# EAGLE design Sen (EAGLE 6.0)
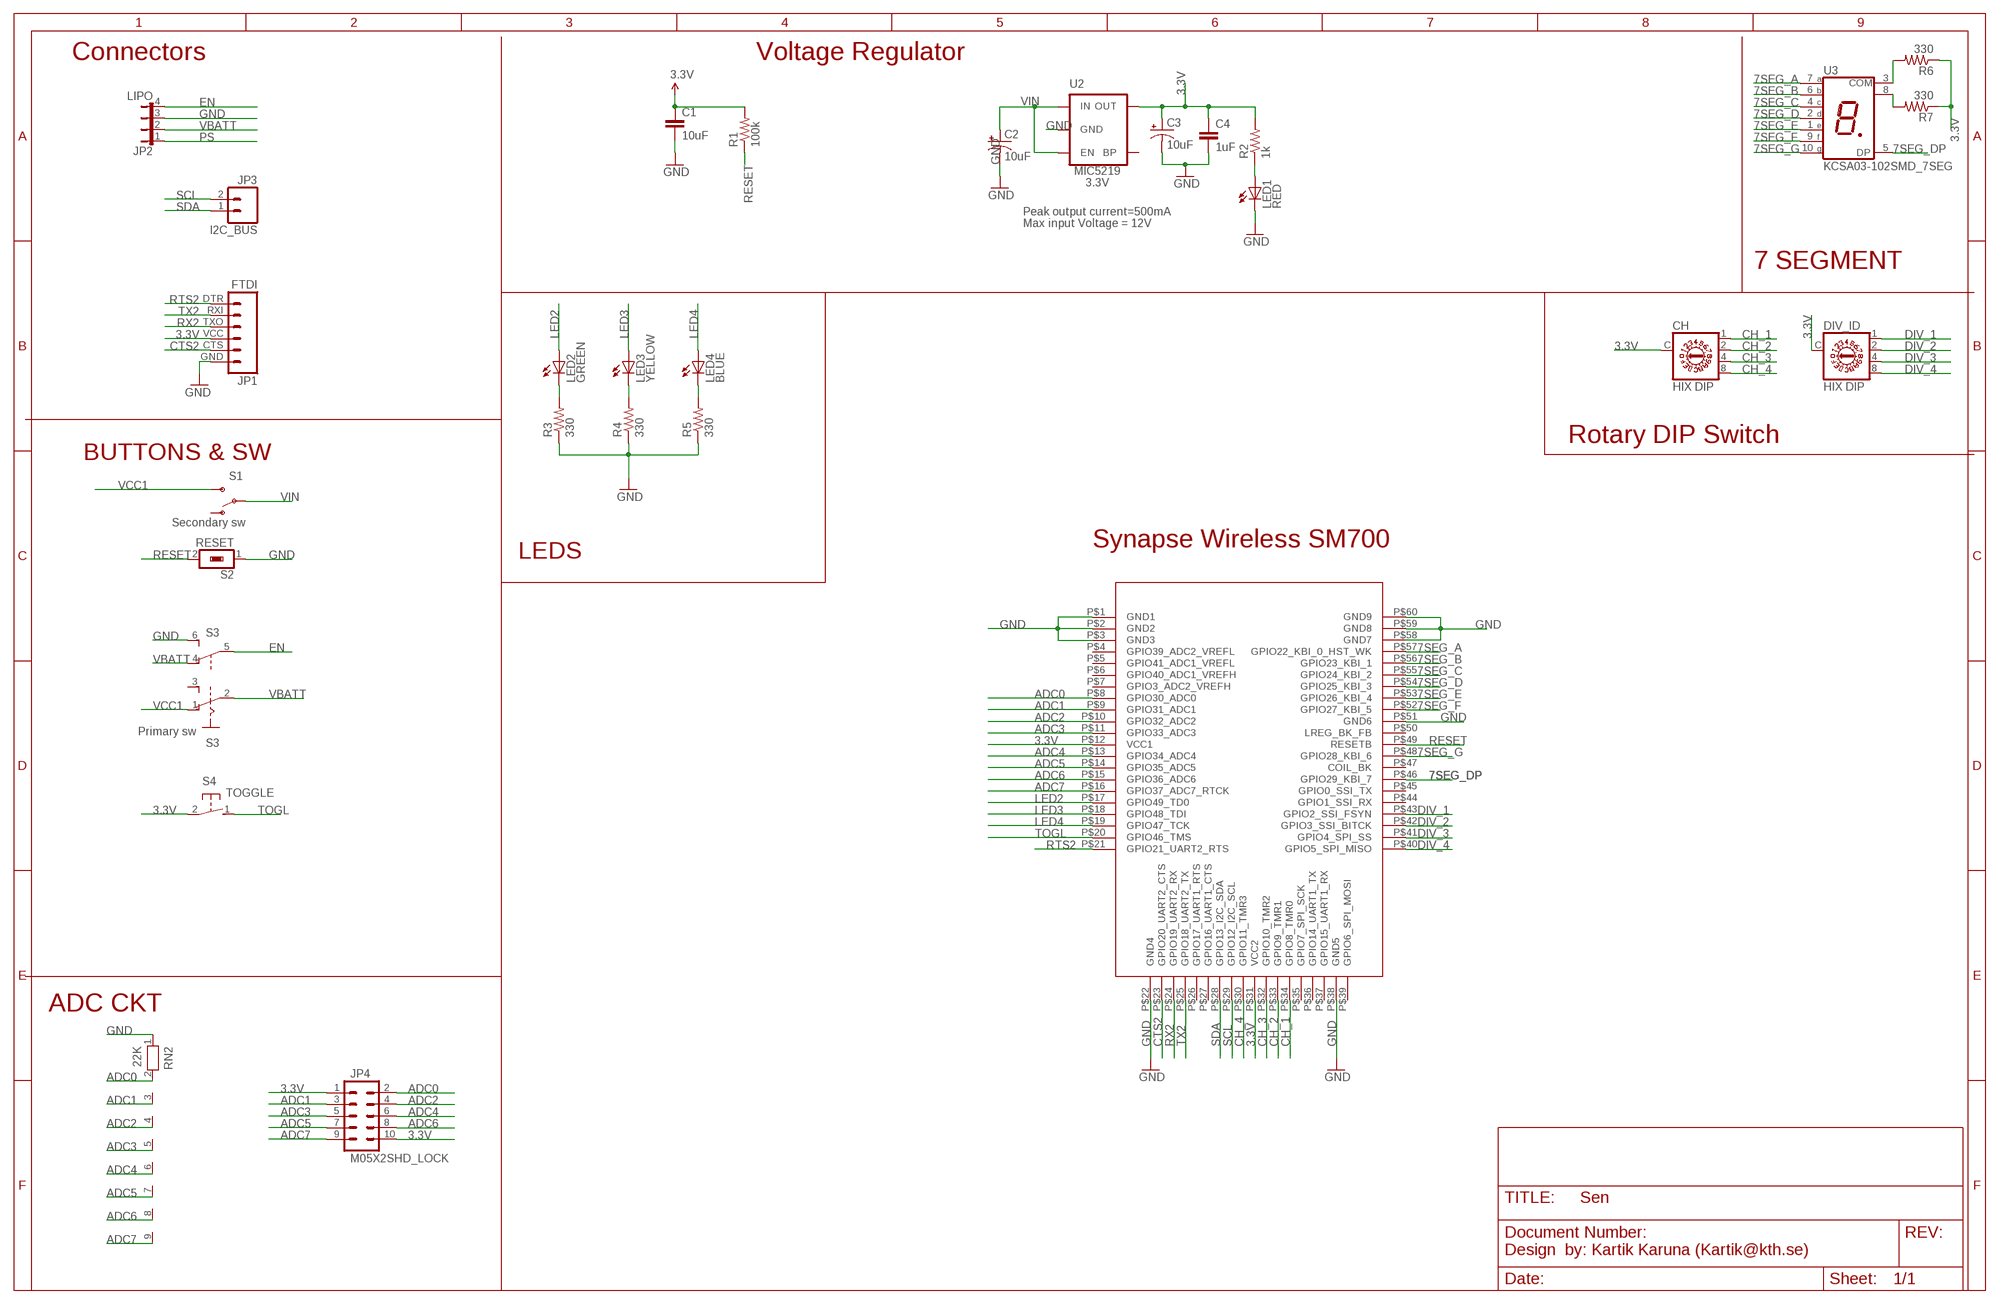
[diagram p0: schematic, sheet 1]

## Parts
C1  10uF  CAP0603-CAP  [0603-CAP]
C2  10uF  CAP_POL3528  [EIA3528]
C3  10uF  CAP_POL3528  [EIA3528]
C4  1uF  CAP0402-CAP  [0402-CAP]
CH  HIX DIP  A1353HEX  [A1353HEX]
DIV_ID  HIX DIP  A1353HEX  [A1353HEX]
JP1  FTDI  FTDI_BASICPTH  [FTDI_BASIC]
JP2  LIPO  JP4E  [JP4]
JP3  I2C_BUS  M021X02_NO_SILK  [1X02_NO_SILK]
JP4  M05X2SHD_LOCK  [2X5-SHROUDED_LOCK]
LED1  RED  LED0603  [LED-0603]
LED2  GREEN  LED0603  [LED-0603]
LED3  YELLOW  LED0603  [LED-0603]
LED4  BLUE  LED0603  [LED-0603]
R1  100k  RESISTOR0805-RES  [0805]
R2  1k  RESISTOR0805-RES  [0805]
R3  330  RESISTOR0603-RES  [0603-RES]
R4  330  RESISTOR0603-RES  [0603-RES]
R5  330  RESISTOR0603-RES  [0603-RES]
R6  330  RESISTOR0603-RES  [0603-RES]
R7  330  RESISTOR0603-RES  [0603-RES]
RN2  22K  RN08  [RN-9]
S1  Secondary sw  SWITCH-SPDTSMD  [AYZ0202]
S2  RESET  TYCO_FSMSFSMSM  [TYCO_FSM]
S3  Primary sw  A68-A31  [A68-A31]
S4  TOGGLE  TYCO_FSMRACDA  [TYCO_FSMRACDA]
U1  SM700PC1SMD  [SYNAPSE_SN700PC1]
U2  MIC5219  V_REG_LDOSMD  [SOT23-5]
U3  KCSA03-102SMD_7SEG  [SMD-7SEG]

## Nets
3.3V: C1.1 C3.A(+) C4.1 CH.C DIV_ID.C JP1.VCC JP4.1 JP4.10 R1.2 R2.2 R6.1 R7.1 S4.2 U1.P$12(VCC1) U1.P$31(VCC2) U2.5(OUT)
7SEG_A: U1.P$57(GPIO22_KBI_0_HST_WK) U3.7(A)
7SEG_B: U1.P$56(GPIO23_KBI_1) U3.6(B)
7SEG_C: U1.P$55(GPIO24_KBI_2) U3.4(C)
7SEG_D: U1.P$54(GPIO25_KBI_3) U3.2(D)
7SEG_DP: U1.P$46(GPIO29_KBI_7) U3.5(DP)
7SEG_E: U1.P$53(GPIO26_KBI_4) U3.1(E)
7SEG_F: U1.P$52(GPIO27_KBI_5) U3.9(F)
7SEG_G: U1.P$48(GPIO28_KBI_6) U3.10(G)
ADC0: JP4.2 RN2.2 U1.P$8(GPIO30_ADC0)
ADC1: JP4.3 RN2.3 U1.P$9(GPIO31_ADC1)
ADC2: JP4.4 RN2.4 U1.P$10(GPIO32_ADC2)
ADC3: JP4.5 RN2.5 U1.P$11(GPIO33_ADC3)
ADC4: JP4.6 RN2.6 U1.P$13(GPIO34_ADC4)
ADC5: JP4.7 RN2.7 U1.P$14(GPIO35_ADC5)
ADC6: JP4.8 RN2.8 U1.P$15(GPIO36_ADC6)
ADC7: JP4.9 RN2.9 U1.P$16(GPIO37_ADC7_RTCK)
CH_1: CH.1 U1.P$34(GPIO8_TMR0)
CH_2: CH.2 U1.P$33(GPIO9_TMR1)
CH_3: CH.4 U1.P$32(GPIO10_TMR2)
CH_4: CH.8 U1.P$30(GPIO11_TMR3)
CTS2: JP1.CTS U1.P$23(GPIO20_UART2_CTS)
DIV_1: DIV_ID.1 U1.P$43(GPIO2_SSI_FSYN)
DIV_2: DIV_ID.2 U1.P$42(GPIO3_SSI_BITCK)
DIV_3: DIV_ID.4 U1.P$41(GPIO4_SPI_SS)
DIV_4: DIV_ID.8 U1.P$40(GPIO5_SPI_MISO)
EN: JP2.4 S3.5(B:P)
GND: C1.2 C2.C(-) C3.C(-) C4.2 JP1.GND JP2.3 LED1.C R3.1 R4.1 R5.1 RN2.1 S2.1 S3.6(B:S) U1.P$1(GND1) U1.P$2(GND2) U1.P$3(GND3) U1.P$22(GND4) U1.P$38(GND5) U1.P$51(GND6) U1.P$58(GND7) U1.P$59(GND8) U1.P$60(GND9) U2.2(GND)
LED2: LED2.A U1.P$17(GPIO49_TD0)
LED3: LED3.A U1.P$18(GPIO48_TDI)
LED4: LED4.A U1.P$19(GPIO47_TCK)
N$1: LED3.C R4.2
N$2: LED1.A R2.1
N$3: R6.2 U3.3(COM)
N$4: LED2.C R3.2
N$5: R7.2 U3.8(COM)
N$6: LED4.C R5.2
PS: JP2.1
RESET: R1.1 S2.2 U1.P$49(RESETB)
RTS2: JP1.DTR U1.P$21(GPIO21_UART2_RTS)
RX2: JP1.TXO U1.P$24(GPIO19_UART2_RX)
SCL: JP3.2 U1.P$29(GPIO12_I2C_SCL)
SDA: JP3.1 U1.P$28(GPIO13_I2C_SDA)
TOGL: S4.1 U1.P$20(GPIO46_TMS)
TX2: JP1.RXI U1.P$25(GPIO18_UART2_TX)
VBATT: JP2.2 S3.2(A:P) S3.4(B:O)
VCC1: S1.3(S) S3.1(A:O)
VIN: C2.A(+) S1.2(P) U2.1(IN) U2.3(EN)
Unconnected: S1.1(O) S3.3(A:S) U1.P$4(GPIO39_ADC2_VREFL) U1.P$5(GPIO41_ADC1_VREFL) U1.P$6(GPIO40_ADC1_VREFH) U1.P$7(GPIO3_ADC2_VREFH) U1.P$26(GPIO17_UART1_RTS) U1.P$27(GPIO16_UART1_CTS) U1.P$35(GPIO7_SPI_SCK) U1.P$36(GPIO14_UART1_TX) U1.P$37(GPIO15_UART1_RX) U1.P$39(GPIO6_SPI_MOSI) U1.P$44(GPIO1_SSI_RX) U1.P$45(GPIO0_SSI_TX) U1.P$47(COIL_BK) U1.P$50(LREG_BK_FB) U2.4(BP)

## Notes on the sheet
- Connectors | Voltage Regulator
- 3.3V
- Peak output current=500mA
- Max input Voltage = 12V
- 7 SEGMENT
- BUTTONS & SW | Rotary DIP Switch
- Synapse Wireless SM700
- LEDS
- ADC CKT
- Design  by: Kartik Karuna (Kartik@kth.se)

## Library data of the parts
C1 C4 = SparkFun-Passives:CAP: Capacitor Standard 0603 ceramic capacitor, and 0.1" leaded capacitor.
C2 C3 = SparkFun-Passives:CAP_POL: Capacitor Polarized These are standard SMD and PTH capacitors. Normally 10uF, 47uF, and 100uF in electrolytic and tantalum varieties. Always verify the external diameter of the through hole cap, it varies with capacity, voltage, and manufacturer. The EIA devices should be standard.
CH DIV_ID = switch-dil:A1353HEX: DIL/CODE SWITCH; OC_FARNELL: unknown; OC_NEWARK: unknown
JP1 = SparkFun-Connectors:FTDI_BASIC: FTDI Basic header with labels
JP2 = jumper:JP4E: JUMPER
JP3 = SparkFun-Connectors:M02: Header 2 Standard 2-pin 0.1" header. Use with straight break away headers (SKU : PRT-00116), right angle break away headers (PRT-00553), swiss pins (PRT-00743), machine pins (PRT-00117), and female headers (PRT-00115). Molex polarized connector foot print use with SKU : PRT-08233 with associated crimp pins and housings.
JP4 = SparkFun-Connectors:M05X2: Header 5x2 Standard 10-pin dual row 0.1" header. Commonly used with AVR-ISP. Use with Spark Fun Electronics SKU: PRT-00778
LED1-LED4 = SparkFun-LED:LED: LEDs Standard schematic elements and footprints for 5mm, 3mm, 1206, and 0603 sized LEDs. 5mm - Spark Fun Electronics SKU : COM-00529 (and others)
R1-R7 = SparkFun-Passives:RESISTOR: Resistor Basic schematic elements and footprints for 0603, 1206, and PTH resistors.
RN2 = resistor-net:RN08: RESISTOR NETWORK; OC_FARNELL: unknown; OC_NEWARK: unknown
S1 = SparkFun-Electromechanical:SWITCH-SPDT: SPDT Switch Simple slide switch, Spark Fun Electronics SKU : COM-00102 DPDT SMT slide switch, AYZ0202, SWCH-08179; PROD_ID: SWCH-08179
S2 = cy_fsmsm:TYCO_FSMS: FSMSM 12 VDC 50 mA, FSM-SM https://www1.elfa.se/data1/wwwroot/assets/datasheets/unAlcoswitch_FSM_dat_en.pdf
S3 = switch:A68-A31: SLIDING SWITCH Siemens, distributor Buerklin, 11G766
S4 = cy_fsmsm:TYCO_FSMRACDA: Rated voltage 12 VDC Rated current 50 mA Actuation force 100 g Design Through-Hole Switching type Momentary function Test voltage 250 V Contact material Ag Description FSMRACD https://www1.elfa.se/data1/wwwroot/assets/datasheets/unAlcoswitch_FSM_dat_en.pdf
U1 = Synapse_SM700PC1:SM700PC1: This device is an ARM7 32bit RF device made by Synapse-Wireless
U2 = SparkFun-PowerIC:V_REG_LDO: Voltage Regulator LDO Standard 150mA LDO voltage regulator in SOT-23 layout. Micrel part MIC5205. BP (by-pass) pin is used to lower output noise with 470pF cap.
U3 = cy-7-seg:KCSA03-102: SURFACE MOUNT DISPLAY Light colour green Character height 7.62 mm Polarity C.C. Decimal point right Peak wave length 565 nm Rated on-state current (per LED) 20 mA Forward voltage 2.2 VDC Light intensity typ. 10000 mcd@ 10 mA Conducting-state voltage max. 2.5 VDC https://www1.elfa.se/data1/wwwroot/assets/datasheets/caKingbright_SMD-LED-Display-KCSC03102_E.pdf

## Board
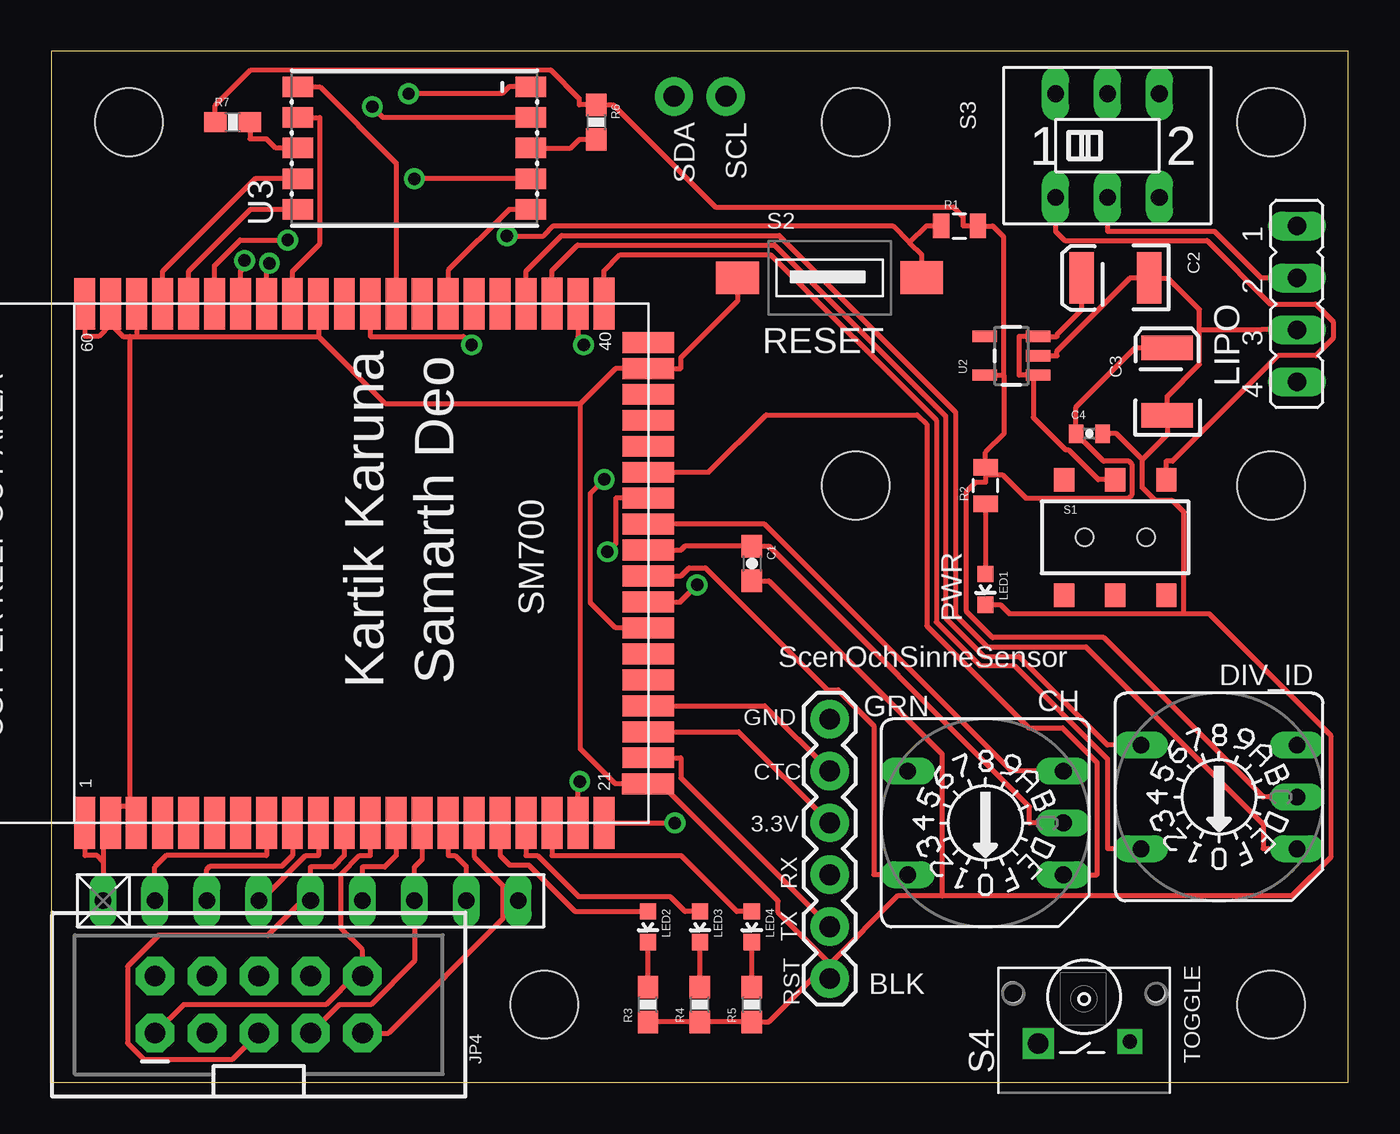
[diagram p1: board, top side]
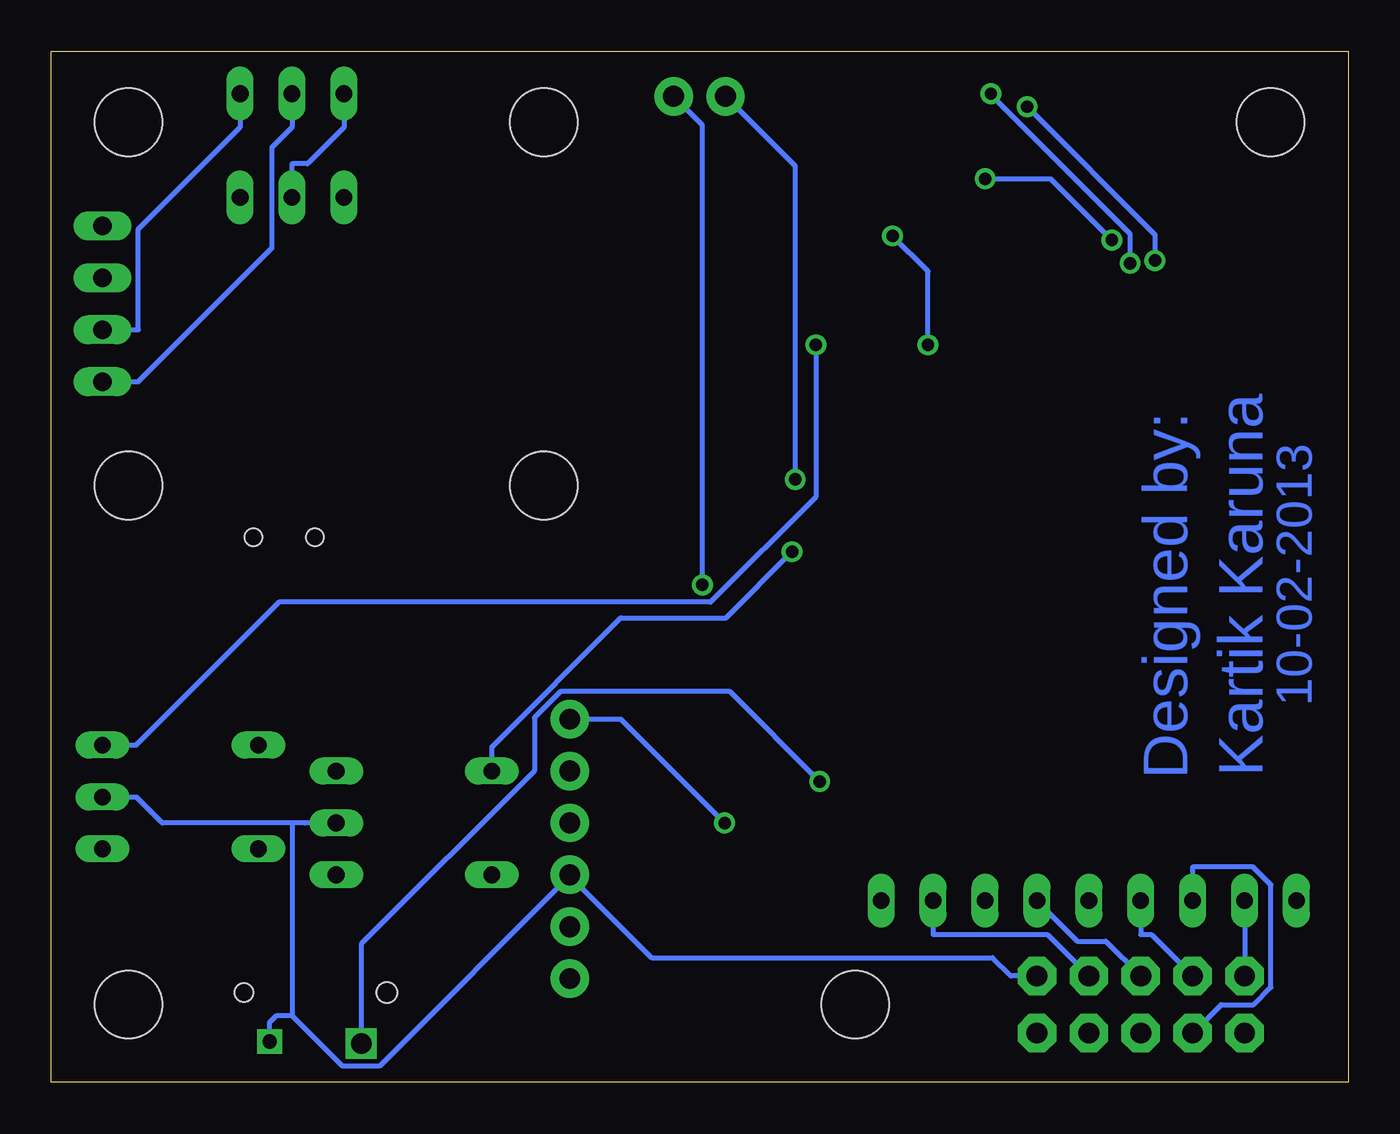
[diagram p2: board, bottom side, seen from below]

Size 63.48 x 50.47 mm. Coordinates in mm from the lower left corner, seen from the top.
Outline: 0,0 63.48,0 63.48,50.47 0,50.47 0,0
Copper layers (1*16): Top 0.035mm / dielectric 1.5mm / Bottom 0.035mm
Design rules: minimum track width 10mil, minimum drill 24mil, track to track 8mil, track to pad 8mil, pad to pad 8mil, via to via 8mil, smd to smd 8mil, copper to edge 40mil, drill to drill 8mil, minimum pad ring 10mil, minimum via ring 8mil, stop-mask expansion 4mil, vias tented up to drill 0mil, thermal gap 10mil
bKeepout: area 36.4,44.2 to 42.3,49.8
tRestrict: area 57.1,26.7 to 62.2,31.8; area 36.7,26.5 to 42.3,32.1; area 36.6,44.2 to 42.2,49.8; area 49.5,25.4 to 54.6,27.9; area 46.6,3.7 to 47.6,5; area 53.3,3.8 to 54.6,5.1
bRestrict: area 57.1,26.7 to 62.2,31.8; area 36.7,26.4 to 42.3,32.1; area 49.5,25.4 to 54.6,27.9; area 53.3,3.8 to 54.6,5.1; area 46.6,3.7 to 47.6,5

### Footprints (pad centres in the part's own frame; a part is rotated, then mirrored left to right if it is on the bottom)
0603-CAP = smd 1.1 x 1: 1 -0.85,0; 2 0.85,0
EIA3528 = smd 1.2 x 2.5: A 1.65,0; C -1.65,0
0402-CAP = smd 0.7 x 0.9: 1 -0.65,0; 2 0.65,0
A1353HEX = drill 0.813 long: 1 3.81,-2.54; 2 -3.81,2.54; 4 3.81,2.54; 8 -3.81,-2.54; C 3.81,0
FTDI_BASIC = drill 1.016 pad 1.88: CTS 10.16,0; DTR 0,0; GND 12.7,0; RXI 2.54,0; TXO 5.08,0; VCC 7.62,0
JP4 = drill 0.914 long: 1 -3.81,0; 2 -1.27,0; 3 1.27,0; 4 3.81,0
1X02_NO_SILK = drill 1.016 pad 1.88: 1 0,0; 2 2.54,0
2X5-SHROUDED_LOCK = drill 1.016 pad 1.88 octagon: 1 -1.397,5.08; 2 1.397,5.08; 3 -1.397,2.54; 4 1.397,2.54; 5 -1.397,0; 6 1.397,0; 7 -1.397,-2.54; 8 1.397,-2.54; 9 -1.397,-5.08; 10 1.397,-5.08
STAND-OFF = hole 3.302: 0,0
LED-0603 = smd 0.8 x 0.8: A 0,-0.75; C 0,0.75
0805 = smd 0.8 x 1.2: 1 -0.9,0; 2 0.9,0
0603-RES = smd 1.1 x 1: 1 -0.85,0; 2 0.85,0
RN-9 = drill 0.813 long: 1 -10.16,0; 2 -7.62,0; 3 -5.08,0; 4 -2.54,0; 5 0,0; 6 2.54,0; 7 5.08,0; 8 7.62,0; 9 10.16,0
AYZ0202 = smd 1 x 1.15: 1 -2.5,2.825; 2 0,2.825; 3 2.5,2.825; 4 -2.5,-2.825; 5 0,-2.825; 6 2.5,-2.825 | hole 0.85: 1.5,0; -1.5,0
TYCO_FSM = smd 1.6 x 2.1: 1 0,-4.51; 2 -0.01,4.5
A68-A31 = drill 0.813 long: 1 -2.54,-2.54; 2 0,-2.54; 3 2.54,-2.54; 4 -2.54,2.54; 5 0,2.54; 6 2.54,2.54
TYCO_FSMRACDA = drill 1 square: 1 0,2.24 | drill 0.7 square: 2 0.1,-2.24 | hole 1: 2.5,3.5 | hole 0.9: 2.5,-3.5
SYNAPSE_SN700PC1 = smd 2.54 x 1.02: P$1 0,28.83; P$2 0,27.56; P$3 0,26.32; P$4 0,25.02; P$5 0,23.75; P$6 0,22.48; P$7 0,21.21; P$8 0,19.94; P$9 0,18.67; P$10 0,17.4; P$11 0,16.13; P$12 0,14.86; P$13 0,13.59; P$14 0,12.32; P$15 0,11.05; P$16 0,9.78; P$17 0,8.51; P$18 0,7.24; P$19 0,5.97; P$20 0,4.7; P$21 0,3.43; P$40 25.41,3.43; P$41 25.4,4.7; P$42 25.42,5.97; P$43 25.4,7.24; P$44 25.4,8.51; P$45 25.4,9.78; P$46 25.4,11.05; P$47 25.4,12.32; P$48 25.4,13.59; P$49 25.4,14.86; P$50 25.4,16.13; P$51 25.4,17.4; P$52 25.4,18.67; P$53 25.4,19.94; P$54 25.4,21.21; P$55 25.4,22.48; P$56 25.4,23.75; P$57 25.4,25.02; P$58 25.4,26.29; P$59 25.4,27.56; P$60 25.4,28.83 | smd 1.02 x 2.54: P$22 1.91,1.27; P$23 3.19,1.26; P$24 4.46,1.26; P$25 5.73,1.26; P$26 7,1.26; P$27 8.27,1.26; P$28 9.54,1.26; P$29 10.82,1.26; P$30 12.09,1.26; P$31 13.35,1.26; P$32 14.62,1.26; P$33 15.89,1.26; P$34 17.16,1.26; P$35 18.43,1.26; P$36 19.7,1.26; P$37 20.97,1.26; P$38 22.24,1.26; P$39 23.51,1.26
SOT23-5 = smd 0.55 x 1.2: 1 -0.95,-1.3; 2 0,-1.3; 3 0.95,-1.3; 4 0.95,1.3; 5 -0.95,1.3
SMD-7SEG = smd 1 x 1.5: 1 3,-5.7; 2 1.5,-5.7; 3 0,-5.7; 4 -1.5,-5.7; 5 -3,-5.7; 6 -3,5.7; 7 -1.5,5.7; 8 0,5.7; 9 1.5,5.7; 10 3,5.7

### Placement (x,y rotation side)
C1  34.29,25.4 270 top
C2  52.07,39.37 180 top
C3  54.61,34.29 90 top
C4  50.8,31.75 0 top
CH  45.72,12.7 0 top
DIV_ID  57.15,13.97 0 top
JP1  38.1,17.78 270 top
JP2  60.96,38.1 270 top
JP3  30.48,48.26 0 top
JP4  10.16,3.81 90 top
JP5  STAND-OFF  [STAND-OFF]  59.69,29.21 0 top
JP6  STAND-OFF  [STAND-OFF]  39.37,29.21 0 top
JP7  STAND-OFF  [STAND-OFF]  59.69,3.81 0 top
JP8  STAND-OFF  [STAND-OFF]  24.13,3.81 0 top
JP9  STAND-OFF  [STAND-OFF]  3.81,46.99 0 top
JP10  STAND-OFF  [STAND-OFF]  39.37,46.99 0 top
JP11  STAND-OFF  [STAND-OFF]  59.69,46.99 0 top
LED1  45.72,24.13 180 top
LED2  29.21,7.62 180 top
LED3  31.75,7.62 180 top
LED4  34.29,7.62 180 top
R1  44.45,41.91 0 top
R2  45.72,29.21 90 top
R3  29.21,3.81 90 top
R4  31.75,3.81 90 top
R5  34.29,3.81 90 top
R6  26.67,46.99 270 top
R7  8.89,46.99 0 top
RN2  12.7,8.89 0 top
S1  52.07,26.67 0 top
S2  38.1,39.37 270 top
S3  51.69,45.85 0 top
S4  50.55,1.91 90 top
U1  30.48,12.7 90 top
U2  46.99,35.56 90 top
U3  17.78,45.72 90 top

### Tracks (layer width: path | path; a pad name or v marks a point on that pad's centre or on a via)
3.3V
  Top 0.254: 15.24,5.24 14.88,5.24 13.45,3.81 6.48,3.81 JP4.1 | 15.24,5.24 15.24,6.48 14.2,7.52 14.2,10.19 15.1,11.1 15.62,11.1 U1.P$12 | JP4.10 15.24,5.24 | CH.C 47.88,12.7 47.88,13.49 35.12,26.25 C1.1 31.02,26.25 30.82,26.05 U1.P$31 | 45.72,29.75 46.54,29.75 47.69,28.59 52.71,28.59 52.9,28.78 52.9,30.24 52.74,30.4 51.5,30.4 C4.1 50.15,33.06 53.03,35.94 C3.A | 45.72,29.75 45.72,29.38 45.26,29.38 44.79,28.91 44.79,23.04 46.06,21.77 51.51,21.77 59.31,13.97 DIV_ID.C | 45.72,29.75 R2.2 45.72,30.84 46.62,31.74 46.62,34.61 | 46.62,34.61 46.62,41.37 46.08,41.91 R1.2 44.98,41.91 44.62,41.91 44.62,42.37 44.15,42.84 32.5,42.84 27.5,47.84 R6.1 26.25,47.84 25.84,47.84 25.84,48.15 24.44,49.55 9.77,49.55 8.04,47.82 R7.1 | U2.5 46.62,34.61
  Bottom 0.254: 38.1,10.11 JP1.VCC | 51.68,3.26 49.24,0.82 47.39,0.82 38.1,10.11 | 38.1,10.11 34.1,6.11 17.41,6.11 16.51,5.21 JP4.10 | 51.68,12.7 51.68,3.26 | 51.68,3.26 52.47,3.26 52.79,2.94 S4.2 | 51.68,12.7 58.04,12.7 59.31,13.97 DIV_ID.C | 51.68,12.7 51.07,12.7 CH.C
7SEG_A
  Top 0.254: U3.7 9.98,44.22 5.46,39.7 U1.P$57
7SEG_B
  Top 0.254: U1.P$56 6.73,39.7 9.75,42.72 U3.6
7SEG_C  (via drill 0.61 pad 1.02)
  Top 0.254: v11.57,41.22 9.24,41.22 8,39.98 8,39.7 U1.P$55 | U3.4 v17.77,44.22
  Bottom 0.254: v17.77,44.22 14.57,44.22 v11.57,41.22
7SEG_D  (via drill 0.61 pad 1.02)
  Top 0.254: v9.47,40.22 9.47,39.9 9.27,39.7 U1.P$54 | v9.47,40.22 | U3.2 16.25,47.22 v15.72,47.75
  Bottom 0.254: v15.72,47.75 9.47,41.5 v9.47,40.22
7SEG_DP
  Top 0.254: U3.5 22.4,42.72 19.43,39.75 U1.P$46
7SEG_E  (via drill 0.61 pad 1.02)
  Top 0.254: U1.P$53 10.54,39.95 v10.69,40.09 | U3.1 22.4,48.72 22.07,48.38 v17.49,48.38
  Bottom 0.254: v17.49,48.38 17.49,48.34 10.69,41.53 v10.69,40.09
7SEG_F
  Top 0.254: U1.P$52 11.81,39.7 13.16,41.05 13.16,47.22 U3.9
7SEG_G
  Top 0.254: U3.10 13.16,48.72 16.89,44.99 U1.P$48
ADC0
  Top 0.254: RN2.2 5.08,10.54 5.64,11.1 10.54,11.1 U1.P$8
  Bottom 0.254: RN2.2 JP4.2
ADC1
  Top 0.254: U1.P$9 11.81,11.1 11.3,10.59 7.79,10.59 7.62,10.43 RN2.3
  Bottom 0.254: RN2.3 7.62,10.54 4.67,10.54 3.8,9.67 3.8,4.65 4.64,3.81 6.22,3.81 JP4.3
ADC2
  Top 0.254: U1.P$10 13.08,11.1 12.47,11.1 10.26,8.89 RN2.4
  Bottom 0.254: RN2.4 10.16,7.24 9.65,7.24 JP4.4
ADC3
  Top 0.254: 12.7,9.29 10.61,7.2 5.26,7.2 3.74,5.68 3.74,1.92 4.53,1.14 8.88,1.14 JP4.5 | 12.7,9.29 12.7,10.54 13.79,10.54 14.35,11.1 U1.P$11 | RN2.5 12.7,9.29
ADC4
  Top 0.254: U1.P$13 16.89,11.1 16.33,10.54 15.24,10.54 RN2.6
  Bottom 0.254: RN2.6 13.27,6.92 11.87,6.92 JP4.6
ADC5
  Top 0.254: U1.P$14 18.16,10.92 17.78,10.54 RN2.7 17.78,5.94 15.65,3.81 14.1,3.81 JP4.7
ADC6
  Top 0.254: U1.P$15 19.43,11.1 19.76,11.1 20.32,10.54 RN2.8
  Bottom 0.254: RN2.8 20.32,7.24 14.73,7.24 JP4.8
ADC7
  Top 0.254: 22.1,8.89 22.1,8 16.51,2.41 JP4.9 | U1.P$16 20.7,11.05 22.1,9.65 22.1,8.89 | 22.1,8.89 RN2.9
CH_1
  Top 0.254: U1.P$34 32.17,29.86 34.98,32.67 42.39,32.67 42.85,32.21 42.85,22.34 47.84,17.36 49.49,17.36 51.18,15.66 51.18,10.16 CH.1
CH_2  (via drill 0.61 pad 1.02)
  Top 0.254: v27.23,25.97 27.62,26.36 27.62,28.59 U1.P$33
  Bottom 0.254: CH.2 41.91,16.43 35.61,22.73 30.46,22.73 v27.23,25.97
CH_3
  Top 0.254: CH.4 46.98,15.24 34.9,27.32 U1.P$32
CH_4
  Top 0.254: CH.8 40.26,10.16 40.26,17.46 38.51,19.21 37.99,19.21 32.02,25.18 31.21,25.18 30.82,24.79 U1.P$30
CTS2
  Top 0.254: U1.P$23 30.82,15.89 30.82,14.9 JP1.CTS
DIV_1
  Top 0.254: DIV_ID.1 59.31,11.43 59.31,12.64 50.64,21.31 45.82,21.31 44.25,22.88 44.25,32.8 35.62,41.44 24.98,41.44 23.24,39.7 U1.P$43
DIV_2
  Top 0.254: DIV_ID.2 51.69,16.51 47.34,20.85 45.63,20.85 43.77,22.72 43.77,32.61 35.41,40.98 25.77,40.98 24.51,39.72 U1.P$42
DIV_3  (via drill 0.61 pad 1.02)
  Top 0.254: U1.P$41 25.78,36.5 26.06,36.22 v26.06,36.1
  Bottom 0.254: DIV_ID.4 59.31,16.51 52.31,23.51 31.2,23.51 26.06,28.65 v26.06,36.1
DIV_4
  Top 0.254: DIV_ID.8 51.69,11.43 51.69,15.83 47.13,20.4 45.44,20.4 43.31,22.53 43.31,32.41 35.21,40.5 27.84,40.5 27.05,39.71 U1.P$40
EN
  Bottom 0.254: JP2.4 59.21,34.29 52.68,40.82 52.68,45.74 51.69,46.74 S3.5
GND
  Top 0.254: 3.85,36.5 4.19,36.5 | 2.92,37.3 2.92,37.1 | 2.92,37.1 3.52,36.5 3.85,36.5 | 3.85,13.5 3.32,13.5 2.92,13.1 | 3.85,13.5 4.16,13.5 U1.P$3 | 3.85,36.5 3.85,13.5 | 13.08,36.5 16.36,33.23 25.91,33.23 | 4.19,36.5 13.08,36.5 | 25.91,33.23 27.62,34.94 U1.P$38 30.82,34.94 30.82,35.47 33.59,38.24 S2.1 | 25.91,33.23 25.91,16.32 27.61,14.61 U1.P$22 29.84,14.61 35.58,8.88 35.58,8.33 38.1,5.81 | 43.6,9.12 41.41,9.12 38.1,5.81 | 55.44,22.94 56.66,22.94 62.61,16.98 62.61,11.01 60.72,9.12 43.6,9.12 | 43.6,9.12 43.6,16.07 35.12,24.55 C1.2 | 38.1,5.81 JP1.GND 37.24,5.08 35.12,2.96 R5.1 R4.1 R3.1 | 56.19,36.83 56.19,37.83 54.65,39.37 C2.C 52.79,39.37 49.22,35.8 49.22,35.56 U2.2 | 56.19,36.83 56.19,35.15 54.61,33.57 C3.C 54.61,31.71 53.39,30.49 | 56.19,36.83 59.21,36.83 JP2.3 | 55.44,22.94 46.89,22.94 46.45,23.38 LED1.C | 55.44,22.94 55.44,27.9 54.87,28.47 54.02,28.47 53.39,29.11 53.39,30.49 | 53.39,30.49 52.13,31.75 51.79,31.75 C4.2 | 2.92,37.3 2.92,37.7 U1.P$59 | U1.P$58 4.19,36.5 | U1.P$51 13.08,36.5 | U1.P$60 1.65,36.5 2.32,36.5 2.92,37.1 | 2.92,37.3 2.92,37.1 | U1.P$1 1.65,11.1 2.25,11.1 2.54,10.8 | 2.54,10.8 RN2.1 | 2.92,13.1 2.54,12.72 2.54,10.8 | U1.P$2 2.92,13.1
  Bottom 0.254: S3.6 54.23,46.74 59.21,41.76 59.21,36.83 JP2.3
LED2
  Top 0.254: LED2.A 25.65,8.37 23.37,10.64 22.43,10.64 21.97,11.1 U1.P$17
LED3
  Top 0.254: LED3.A 31.02,8.37 30.29,9.1 25.8,9.1 23.8,11.1 23.24,11.1 U1.P$18
LED4
  Top 0.254: LED4.A 33.56,8.37 30.83,11.1 24.51,11.1 U1.P$19
N$1
  Top 0.254: R4.2 LED3.C
N$2
  Top 0.254: R2.1 LED1.A
N$3
  Top 0.254: R6.2 25.84,46.14 25.42,45.72 U3.3
N$4
  Top 0.254: R3.2 LED2.C
N$5
  Top 0.254: R7.2 9.74,46.16 10.56,46.16 11,45.72 U3.8
N$6
  Top 0.254: R5.2 LED4.C
RESET  (via drill 0.61 pad 1.02)
  Top 0.254: U1.P$49 15.62,36.5 20.18,36.5 v20.57,36.1 | v22.31,41.42 24.09,41.42 24.58,41.92 41.19,41.92 42.01,41.1 | 42.01,41.1 42.6,40.51 S2.2 | 42.01,41.1 42.82,41.91 R1.1
  Bottom 0.254: v20.57,36.1 20.57,39.69 v22.31,41.42
RTS2  (via drill 0.61 pad 1.02)
  Top 0.254: U1.P$21 v30.53,12.7
  Bottom 0.254: JP1.DTR 35.61,17.78 v30.53,12.7
RX2
  Top 0.254: U1.P$24 33.64,17.16 JP1.TXO
SCL  (via drill 0.61 pad 1.02)
  Top 0.254: U1.P$29 30.82,23.52 30.82,23.55 v31.61,24.35
  Bottom 0.254: v31.61,24.35 31.61,46.85 JP3.2
SDA  (via drill 0.61 pad 1.02)
  Top 0.254: U1.P$28 27.62,22.24 26.39,23.47 26.39,28.83 v27.07,29.51
  Bottom 0.254: v27.07,29.51 27.07,44.85 JP3.1
TOGL  (via drill 0.61 pad 1.02)
  Top 0.254: U1.P$20 25.78,14.63 v25.87,14.73
  Bottom 0.254: v25.87,14.73 30.27,19.13 38.55,19.13 39.83,17.85 39.83,15.25 48.31,6.78 S4.1
TX2
  Top 0.254: U1.P$25 34.91,18.43 JP1.RXI
VBATT
  Top 0.254: S3.2 51.69,41.66 56.92,41.66 59.21,39.37 JP2.2
  Bottom 0.254: S3.2 51.69,44.96 50.93,44.96 49.15,46.74 S3.4
VCC1
  Top 0.254: S1.3 54.57,30.4 54.87,30.4 60.03,35.56 61.88,35.56 62.74,36.41 62.74,37.24 61.88,38.1 59.66,38.1 56.57,41.2 49.61,41.2 49.15,41.66 S3.1
VIN
  Top 0.254: S1.2 51.24,29.5 49.77,30.97 49.64,30.97 48.06,32.55 48.06,34.61 | 48.06,34.61 47.36,34.61 47.36,36.51 U2.3 48.64,36.51 49.22,36.51 49.22,36.59 50.42,37.79 C2.A | U2.1 48.06,34.61

### Text on the board
Bottom: 10-02-2013 | Kartik Karuna | Designed by:
tPlace: SDA | SCL | Kartik Karuna | Samarth Deo | PWR | SM700 | ScenOchSinneSensor | GND | GRN | CTC | 3.3V | RX | TX | RST | BLK